# Altium schematic sheet extrasheet.SchDoc
size A4
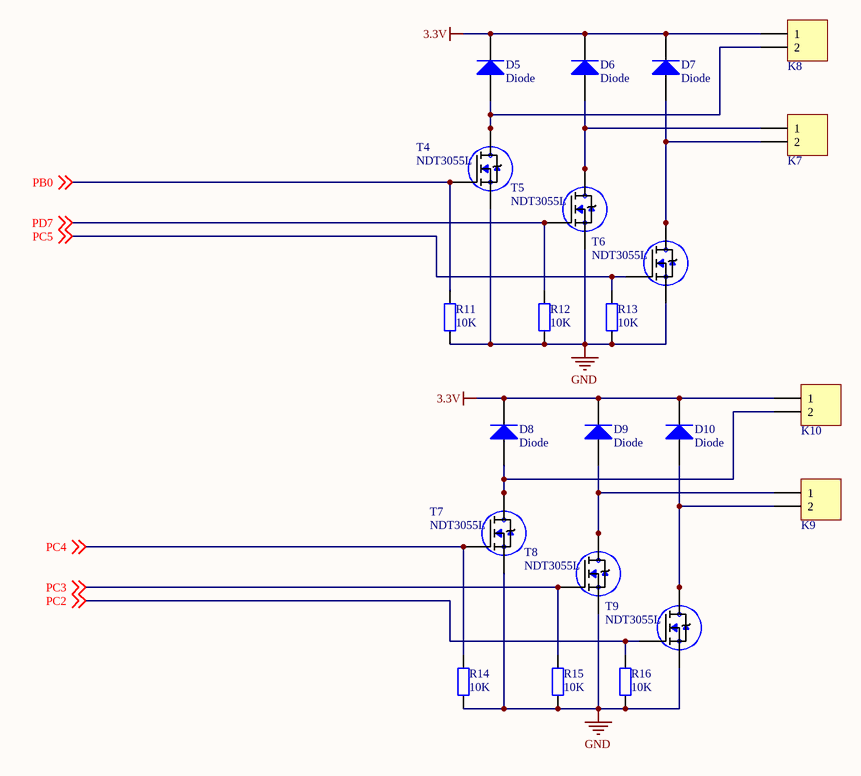
[diagram p0: extrasheet.SchDoc]

## Parts
D5  Diode  [Diode]
D6  Diode  [Diode]
D7  Diode  [Diode]
D8  Diode  [Diode]
D9  Diode  [Diode]
D10  Diode  [Diode]
K7  K7  [K12]
K8  K8  [K12]
K9  K9  [K12]
K10  K10  [K12]
R11  value 10K  [C13+R]  (hidden comment: Res2)
R12  value 10K  [C13+R]  (hidden comment: Res2)
R13  value 10K  [C13+R]  (hidden comment: Res2)
R14  value 10K  [C13+R]  (hidden comment: Res2)
R15  value 10K  [C13+R]  (hidden comment: Res2)
R16  value 10K  [C13+R]  (hidden comment: Res2)
T4  NDT3055L  [*SOT223-4]
T5  NDT3055L  [*SOT223-4]
T6  NDT3055L  [*SOT223-4]
T7  NDT3055L  [*SOT223-4]
T8  NDT3055L  [*SOT223-4]
T9  NDT3055L  [*SOT223-4]

## Nets
3.3V: D5.K D6.K D7.K D8.K D9.K D10.K K8.1 K10.1
GND: R11.2 R12.1 R13.1 R14.2 R15.1 R16.1 T4.3(S) T5.3(S) T6.3(S) T7.3(S) T8.3(S) T9.3(S)
PB0: R11.1 T4.1(G) ; off-sheet PB0
PC2: R16.2 T9.1(G) ; off-sheet PC2
PC3: R15.2 T8.1(G) ; off-sheet PC3
PC4: R14.1 T7.1(G) ; off-sheet PC4
PC5: R13.2 T6.1(G) ; off-sheet PC5
PD7: R12.2 T5.1(G) ; off-sheet PD7
NetD5_A: D5.A K8.2 T4.2(D) T4.4(D)
NetD6_A: D6.A K7.1 T5.2(D) T5.4(D)
NetD7_A: D7.A K7.2 T6.2(D) T6.4(D)
NetD8_A: D8.A K10.2 T7.2(D) T7.4(D)
NetD9_A: D9.A K9.1 T8.2(D) T8.4(D)
NetD10_A: D10.A K9.2 T9.2(D) T9.4(D)

## Library data of the parts
D5-D10 = Diode: Default Diode; Published: 8-Jun-2000; LatestRevisionDate: 17-Jul-2002; LatestRevisionNote: Re-released for DXP Platform.; PackageVersion: Sep-1996; PackageReference: SMC; Publisher: Altium Limited; PackageDescription: DO-214-AB/SMC; 2 C-Bend Leads; Body 7.9 x 5.9 mm, inc. leads (LxW); Code_JEDEC: DO-214-AB
K7-K10 = Header 2: Header, 2-Pin; LatestRevisionDate: 17-Jul-2002; LatestRevisionNote: Re-released for DXP Platform.; Publisher: Altium Limited
R11-R16 = Res2: Resistor; Published: 8-Jun-2000; LatestRevisionDate: 17-Jul-2002; LatestRevisionNote: Re-released for DXP Platform.; PackageReference: AXIAL-0.4; Publisher: Altium Limited; PackageDescription: Axial Device, Thru-Hole; 2 Leads; 0.4 in Pin Spacing
T4-T9 = NDT3055L: SnapEDA_Link: https://www.snapeda.com/parts/NDT3055L/ON%20Semiconductor/view-part/2773473/?ref=snap; Value: *